# Altium schematic sheet Power.SchDoc: Power Converters
size 279 x 215 mm; DrawnBy: Kyle Hong; Engineer: Kyle Hong; Revision: 2; SheetNumber: 1; SheetTotal: 3
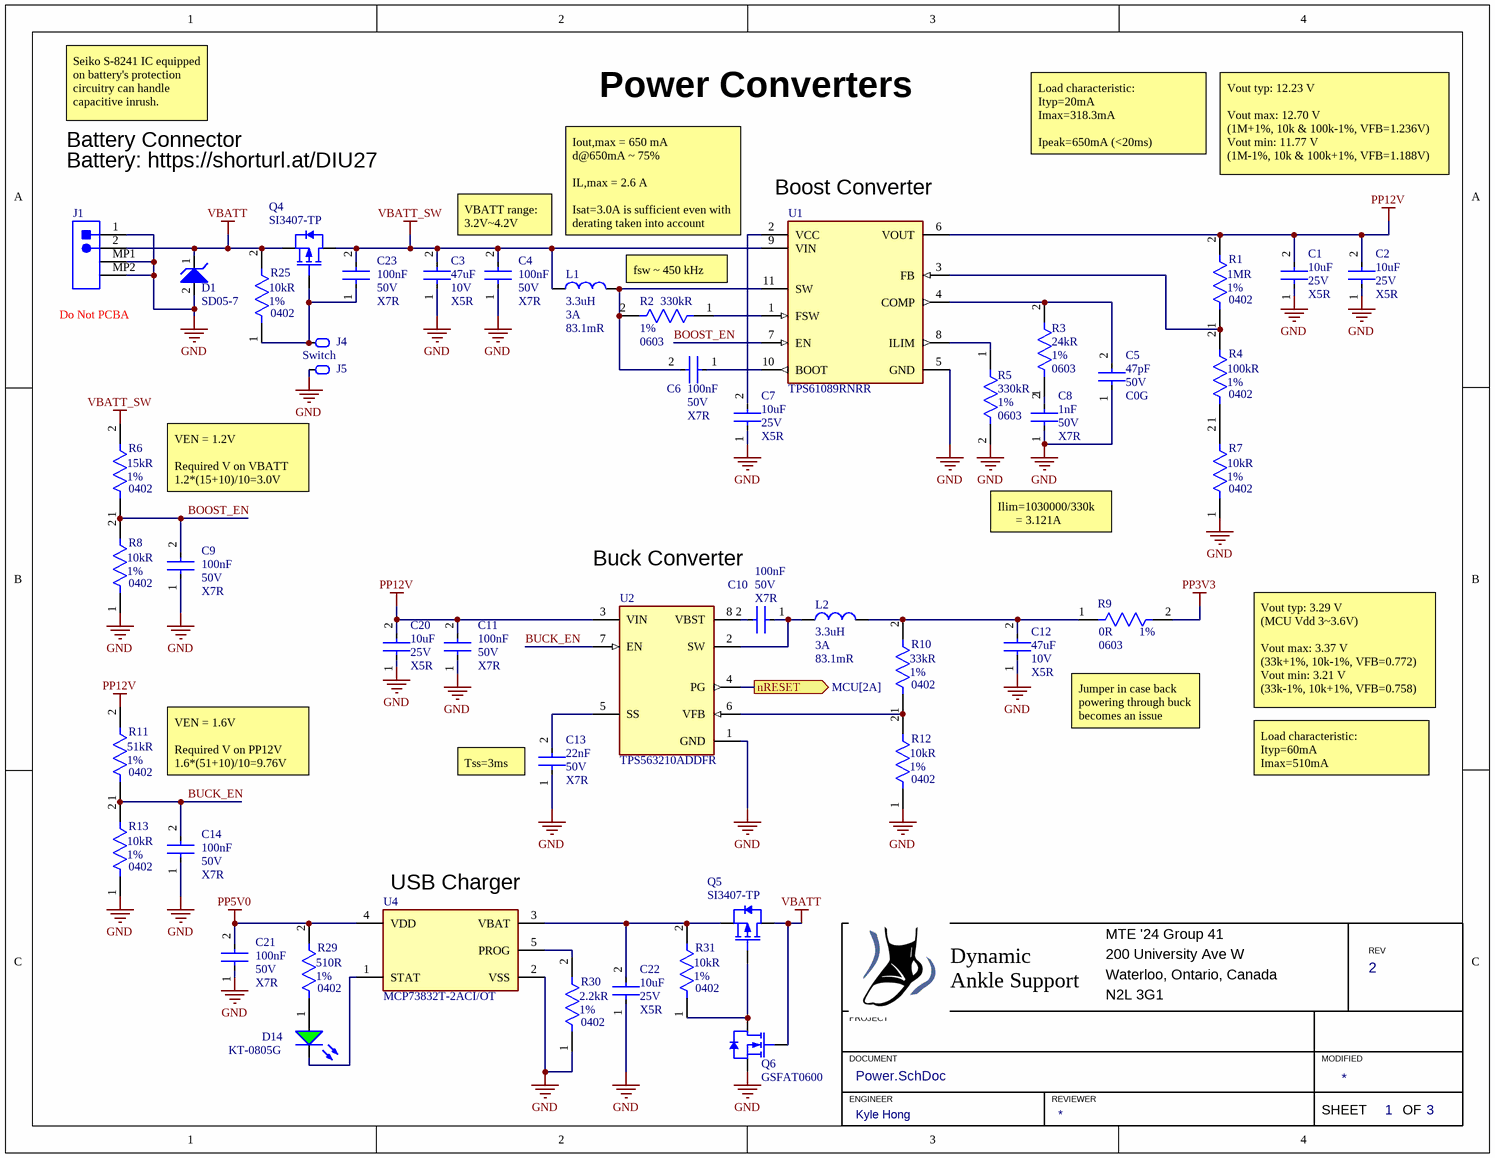
[diagram p0: Power.SchDoc]

## Parts
C1  Dielectric: X5R  Voltage Rating: 25V  Capacitance: 10uF  [CAP0805]  (hidden comment: CL21A106KAYNNNE)
C2  Dielectric: X5R  Voltage Rating: 25V  Capacitance: 10uF  [CAP0805]  (hidden comment: CL21A106KAYNNNE)
C3  Dielectric: X5R  Voltage Rating: 10V  Capacitance: 47uF  [CAP1206]  (hidden comment: CL31A476MPHNNNE)
C4  Dielectric: X7R  Voltage Rating: 50V  Capacitance: 100nF  [CAP0402]  (hidden comment: CL05B104KB54PNC)
C5  Dielectric: C0G  Voltage Rating: 50V  Capacitance: 47pF  [CAP0402]  (hidden comment: 0402CG470J500NT)
C6  Dielectric: X7R  Voltage Rating: 50V  Capacitance: 100nF  [CAP0402]  (hidden comment: CL05B104KB54PNC)
C7  Dielectric: X5R  Voltage Rating: 25V  Capacitance: 10uF  [CAP0805]  (hidden comment: CL21A106KAYNNNE)
C8  Dielectric: X7R  Voltage Rating: 50V  Capacitance: 1nF  [CAP0402]  (hidden comment: 0402B102K500NT)
C9  Dielectric: X7R  Voltage Rating: 50V  Capacitance: 100nF  [CAP0402]  (hidden comment: CL05B104KB54PNC)
C10  Dielectric: X7R  Voltage Rating: 50V  Capacitance: 100nF  [CAP0402]  (hidden comment: CL05B104KB54PNC)
C11  Dielectric: X7R  Voltage Rating: 50V  Capacitance: 100nF  [CAP0402]  (hidden comment: CL05B104KB54PNC)
C12  Dielectric: X5R  Voltage Rating: 10V  Capacitance: 47uF  [CAP1206]  (hidden comment: CL31A476MPHNNNE)
C13  Dielectric: X7R  Voltage Rating: 50V  Capacitance: 22nF  [CAP0402]  (hidden comment: 0402B223K500NT)
C14  Dielectric: X7R  Voltage Rating: 50V  Capacitance: 100nF  [CAP0402]  (hidden comment: CL05B104KB54PNC)
C20  Dielectric: X5R  Voltage Rating: 25V  Capacitance: 10uF  [CAP0805]  (hidden comment: CL21A106KAYNNNE)
C21  Dielectric: X7R  Voltage Rating: 50V  Capacitance: 100nF  [CAP0402]  (hidden comment: CL05B104KB54PNC)
C22  Dielectric: X5R  Voltage Rating: 25V  Capacitance: 10uF  [CAP0805]  (hidden comment: CL21A106KAYNNNE)
C23  Dielectric: X7R  Voltage Rating: 50V  Capacitance: 100nF  [CAP0402]  (hidden comment: CL05B104KB54PNC)
D1  SD05-7  [SD05-7]
D14  KT-0805G  [LED_0805_GREEN]
J1  S2B-PH-SM4-TB(LF)(SN)  [JST- S2B-PH-SM4-TB(LF)(SN)-2_V]  (value not drawn)
J4  SOLDER_PAD  [SOLDER_PAD]  (value not drawn)
J5  SOLDER_PAD  [SOLDER_PAD]  (value not drawn)
L1  DC Resistance: 83.1mR  Isat(min): 3A  Inductance: 3.3uH  [TMPA0503S-3R3MN-D]  (hidden comment: IHLP1616BZER3R3M5A)
L2  DC Resistance: 83.1mR  Isat(min): 3A  Inductance: 3.3uH  [TMPA0503S-3R3MN-D]  (hidden comment: IHLP1616BZER3R3M5A)
Q4  SI3407-TP  [SOT23-3]
Q5  SI3407-TP  [SOT23-3]
Q6  GSFAT0600  [SOT-523]
R1  Tolerance: 1%  Resistance: 1MR  Package: 0402  [RES0402]  (hidden comment: 0402WGF1004TCE)
R2  Tolerance: 1%  Resistance: 330kR  Package: 0603  [RES0603]  (hidden comment: 0603WAF3303T5E)
R3  Tolerance: 1%  Resistance: 24kR  Package: 0603  [RES0603]  (hidden comment: 0603WAF2402T5E)
R4  Tolerance: 1%  Resistance: 100kR  Package: 0402  [RES0402]  (hidden comment: 0402WGF1003TCE)
R5  Tolerance: 1%  Resistance: 330kR  Package: 0603  [RES0603]  (hidden comment: 0603WAF3303T5E)
R6  Tolerance: 1%  Resistance: 15kR  Package: 0402  [RES0402]  (hidden comment: 0402WGF1502TCE)
R7  Tolerance: 1%  Resistance: 10kR  Package: 0402  [RES0402]  (hidden comment: 0402WGF1002TCE)
R8  Tolerance: 1%  Resistance: 10kR  Package: 0402  [RES0402]  (hidden comment: 0402WGF1002TCE)
R9  Tolerance: 1%  Resistance: 0R  Package: 0603  [RES0603]  (hidden comment: 0603WAF0000T5E)
R10  Tolerance: 1%  Resistance: 33kR  Package: 0402  [RES0402]  (hidden comment: 0402WGF3302TCE)
R11  Tolerance: 1%  Resistance: 51kR  Package: 0402  [RES0402]  (hidden comment: 0402WGF5102TCE)
R12  Tolerance: 1%  Resistance: 10kR  Package: 0402  [RES0402]  (hidden comment: 0402WGF1002TCE)
R13  Tolerance: 1%  Resistance: 10kR  Package: 0402  [RES0402]  (hidden comment: 0402WGF1002TCE)
R25  Tolerance: 1%  Resistance: 10kR  Package: 0402  [RES0402]  (hidden comment: 0402WGF1002TCE)
R29  Tolerance: 1%  Resistance: 510R  Package: 0402  [RES0402]  (hidden comment: 0402WGF5100TCE)
R30  Tolerance: 1%  Resistance: 2.2kR  Package: 0402  [RES0402]  (hidden comment: 0402WGF2201TCE)
R31  Tolerance: 1%  Resistance: 10kR  Package: 0402  [RES0402]  (hidden comment: 0402WGF1002TCE)
U1  TPS61089RNRR  [FP-RNR0011A-MFG]
U2  TPS563210ADDFR  [TPS563210ADDFR]
U4  MCP73832T-2ACI/OT  [FP-C04-091-OT-MFG]

## Ports
nRESET (out, see MCU[2A])

## Nets
GND: C1.1 C2.1 C3.1 C4.1 C5.1 C7.1 C8.1 C9.1 C11.1 C12.1 C13.1 C14.1 C20.1 C21.1 C22.1 D1.2 J1.1 J1.MP1 J1.MP2 J5.1 Q6.2(SOURCE) R5.2 R7.1 R8.1 R12.1 R13.1 R30.1 U1.5(GND) U2.1(GND) U4.2(VSS)
PP3V3: R9.2
PP5V0: C21.2 R29.2 U4.4(VDD)
PP12V: C1.2 C2.2 C11.2 C20.2 R1.2 R11.2 U1.6(VOUT) U2.3(VIN)
VBATT: D1.1 J1.2 Q4.2(Source) Q5.3(Drain) Q6.1(GATE) R25.2
VBATT_SW: C3.2 C4.2 C23.2 L1.1 Q4.3(Drain) R6.2 U1.9(VIN)
BOOST_EN: C9.2 R6.1 R8.2 U1.7(EN)
BUCK_EN: C14.2 R11.1 R13.2 U2.7(EN)
nRESET: U2.4(PG) ; port nRESET
NetC5_2: C5.2 R3.2 U1.4(COMP)
NetC6_1: C6.1 U1.10(BOOT)
NetC6_2: C6.2 L1.2 R2.2 U1.11(SW)
NetC7_2: C7.2 U1.2(VCC)
NetC8_2: C8.2 R3.1
NetC10_1: C10.1 L2.1 U2.2(SW)
NetC10_2: C10.2 U2.8(VBST)
NetC12_2: C12.2 L2.2 R9.1 R10.2
NetC13_2: C13.2 U2.5(SS)
NetC22_2: C22.2 Q5.2(Source) R31.2 U4.3(VBAT)
NetC23_1: C23.1 J4.1 Q4.1(Gate) R25.1
NetD14_1: D14.1(K) U4.1(STAT)
NetD14_2: D14.2(A) R29.1
NetQ5_1: Q5.1(Gate) Q6.3(DRAIN) R31.1
NetR1_1: R1.1 R4.2 U1.3(FB)
NetR2_1: R2.1 U1.1(FSW)
NetR4_1: R4.1 R7.2
NetR5_1: R5.1 U1.8(ILIM)
NetR10_1: R10.1 R12.2 U2.6(VFB)
NetR30_2: R30.2 U4.5(PROG)

## Notes on the sheet
- Power Converters
- Battery Connector
- Seiko S-8241 IC equipped on battery's protection circuitry can handle capacitive inrush.
- Load characteristic:
  Ityp=20mA
  Imax=318.3mA
  Ipeak=650mA (<20ms)
- Battery: https://shorturl.at/DIU27
- VBATT range: 3.2V~4.2V
- Iout,max = 650 mA
  d@650mA ~ 75%
  IL,max = 2.6 A
  Isat=3.0A is sufficient even with derating taken into account
- (near U1) Boost Converter
- Vout typ: 12.23 V
  Vout max: 12.70 V
  (1M+1%, 10k & 100k-1%, VFB=1.236V)
  Vout min: 11.77 V
  (1M-1%, 10k & 100k+1%, VFB=1.188V)
- fsw ~ 450 kHz
- (near J1) Do Not PCBA
- Switch
- VEN = 1.2V
  Required V on VBATT
  1.2*(15+10)/10=3.0V
- Buck Converter
- Ilim=1030000/330k
  = 3.121A
- Vout typ: 3.29 V
  (MCU Vdd 3~3.6V)
  Vout max: 3.37 V
  (33k+1%, 10k-1%, VFB=0.772)
  Vout min: 3.21 V
  (33k-1%, 10k+1%, VFB=0.758)
- VEN = 1.6V
  Required V on PP12V
  1.6*(51+10)/10=9.76V
- (near C13) Tss=3ms
- Jumper in case back powering through buck becomes an issue
- Load characteristic:
  Ityp=60mA
  Imax=510mA
- (near U4) USB Charger
- 200 University Ave W
- MTE '24 Group 41
- REV
- PROJECT
- Dynamic Ankle Support
- Waterloo, Ontario, Canada
- N2L 3G1
- DOCUMENT
- ENGINEER
- REVIEWER
- MODIFIED
- SHEET
- OF

## Library data of the parts
C1 C2 C7 C20 C22 = CAP0805: 25V 10uF X5R ±10% 0805  Multilayer Ceramic Capacitors MLCC - SMD/SMT ROHS; Manufacturer: Samsung Electro-Mechanics; Tolerance: 10%; Manufacturer Part Number: CL21A106KAYNNNE; Package: 0805
C3 C12 = CAP1206: 10V 47uF X5R ±20% 1206  Multilayer Ceramic Capacitors MLCC - SMD/SMT ROHS; Manufacturer: Samsung Electro-Mechanics; Tolerance: 20%; Manufacturer Part Number: CL31A476MPHNNNE; Package: 1206
C4 C6 C9-C11 C14 C21 C23 = CAP0402: 50V 100nF X7R ±10% 0402  Multilayer Ceramic Capacitors MLCC - SMD/SMT ROHS; Manufacturer: Samsung Electro-Mechanics; Tolerance: ±20%; Manufacturer Part Number: CL05B104KB54PNC; Package: 0402
C5 = CAP0402: 50V 47pF C0G ±5% 0402  Multilayer Ceramic Capacitors MLCC - SMD/SMT ROHS; Manufacturer: FH (Guangdong Fenghua Advanced Tech); Tolerance: ±5%; Manufacturer Part Number: 0402CG470J500NT; Package: 0402
C8 = CAP0402: 50V 1nF X7R ±10% 0402  Multilayer Ceramic Capacitors MLCC - SMD/SMT ROHS; Manufacturer: FH (Guangdong Fenghua Advanced Tech); Tolerance: ±10%; Manufacturer Part Number: 0402B102K500NT; Package: 0402
C13 = CAP0402: 50V 22nF X7R ±10% 0402  Multilayer Ceramic Capacitors MLCC - SMD/SMT ROHS; Manufacturer: FH (Guangdong Fenghua Advanced Tech); Tolerance: 10%; Manufacturer Part Number: 0402B223K500NT; Package: 0402
D1 = SD05-7: TVS UNI14.5V 6.2V 5V SOD-323; Manufacturer: Diodes Incorporated; Clamping Voltage: 14.5V; Breakdown Voltage: 6.2V; Reverse Standoff Voltage: 5V; Package: SOD-323; Manufacturer Part Number: SD05-7
D14 = LED_GREEN: Emerald 0805  Light Emitting Diodes (LED) ROHS; Manufacturer: Hubei KENTO Elec; Vf: 2.1V; If rated: 20mA; Manufacturer Part Number: KT-0805G
J1 = CMP-1755-00001-1: Male Header, Pitch 2 mm, 1 x 2 Position, Height 5.5 mm, -25 to 85 degC, RoHS, Tape and Reel; Current Rating: 3 A; ComponentLink1URL: http://www.jst.com/home2.html; Radiation Hardening: No; RoHSCompliant: True; Mount: Through Hole; Contact Material: Bronze; Package Quantity: 100; Width: 2.34 mm; DatasheetVersion: Dec-12; Height: 8.13 mm; Max Operating Temperature: 105degC; ComponentLink2Description: Datasheet; Lead Pitch: 0.1 inch; Contact Finish: Lead; Packaging: Bulk; Colour: Black; Contact Plating: Tin; Min Operating Temperature: -65degC; ComponentLink1Description: Manufacturer URL; PackageReference: S2B-PH-SM4-TB(LF)(SN)-2; PackageDescription: Male Header, Pitch 2 mm, 1 x 2 Position, Height 5.5 mm; ComponentLink2URL: http://www.jst-mfg.com/product/pdf/eng/ePH.pdf; Pins: 40; Length: 101.19 mm
L1 L2 = TMPA0503S-3R3MN-D: 3.3uH ±20% 3A SMD Power Inductors ROHS; Manufacturer: Vishay Intertech; Manufacturer Part Number: IHLP1616BZER3R3M5A; Tolerance: 20%
Q4 Q5 = IRLML5103TRPBF: MOSFET P-CH 30V 4.1A SOT23; Manufacturer 1: Micro Commercial Co; Vgs (Max): ±20V; Power Dissipation (Max): 1.3W; Vth (Max): 3V @250uA; Vdss: 30V; Mounting Type: SMD; Manufacturer Part Number 1: SI3407-TP; Supplier 1: Digikey; Supplier Part Number 1: SI3407-TPMSCT-ND
Q6 = DMN62D0UT-7: MOSFET, N-CH, SINGLE, 0.30A, 60V; Vgs(th) (Max) @ Id: 2.5V @ 250uA; Vgs (Max): ±20V; Id @ 25°C: 300mA; Vdss: 60V; Package: SOT-523; Supplier 1: Digikey; Supplier Part Number 1: 4786-GSFAT0600CT-ND
R1 = RES0402: 62.5mW Thick Film Resistors ±100ppm/℃ ±1% 1MΩ 0402  Chip Resistor - Surface Mount ROHS; Manufacturer: UNI-ROYAL(Uniroyal Elec); Power Rating: 62.5mW; Manufacturer Part Number: 0402WGF1004TCE
R2 R5 = RES0603: 100mW Thick Film Resistors ±100ppm/℃ ±1% 330kΩ 0603  Chip Resistor - Surface Mount ROHS; Manufacturer: UNI-ROYAL(Uniroyal Elec); Power Rating: 100mW; Manufacturer Part Number: 0603WAF3303T5E
R3 = RES0603: 100mW Thick Film Resistors ±100ppm/℃ ±1% 24kΩ 0603  Chip Resistor - Surface Mount ROHS; Manufacturer: UNI-ROYAL(Uniroyal Elec); Power Rating: 100mW; Manufacturer Part Number: 0603WAF2402T5E
R4 = RES0402: 62.5mW Thick Film Resistors ±100ppm/℃ ±1% 100kΩ 0402  Chip Resistor - Surface Mount ROHS; Manufacturer: UNI-ROYAL(Uniroyal Elec); Power Rating: 62.5mW; Manufacturer Part Number: 0402WGF1003TCE
R6 = RES0402: 62.5mW Thick Film Resistors ±100ppm/℃ ±1% 15kΩ 0402  Chip Resistor - Surface Mount ROHS; Manufacturer: UNI-ROYAL(Uniroyal Elec); Power Rating: 62.5mW; Manufacturer Part Number: 0402WGF1502TCE
R7 R8 R12 R13 R25 R31 = RES0402: 62.5mW Thick Film Resistors ±100ppm/℃ ±1% 10kΩ 0402  Chip Resistor - Surface Mount ROHS; Manufacturer: UNI-ROYAL(Uniroyal Elec); Power Rating: 62.5mW; Manufacturer Part Number: 0402WGF1002TCE
R9 = RES0603: 100mW Thick Film Resistors ±1% 0Ω 0603  Chip Resistor - Surface Mount ROHS; Manufacturer: UNI-ROYAL(Uniroyal Elec); Power Rating: 100mW; Manufacturer Part Number: 0603WAF0000T5E
R10 = RES0402: 62.5mW Thick Film Resistors ±100ppm/℃ ±1% 33kΩ 0402  Chip Resistor - Surface Mount ROHS; Manufacturer: UNI-ROYAL(Uniroyal Elec); Power Rating: 62.5mW; Manufacturer Part Number: 0402WGF3302TCE
R11 = RES0402: 62.5mW Thick Film Resistors ±100ppm/℃ ±1% 51kΩ 0402  Chip Resistor - Surface Mount ROHS; Manufacturer: UNI-ROYAL(Uniroyal Elec); Power Rating: 62.5mW; Manufacturer Part Number: 0402WGF5102TCE
R29 = RES0402: 62.5mW Thick Film Resistors ±100ppm/℃ ±1% 510Ω 0402  Chip Resistor - Surface Mount ROHS; Manufacturer: UNI-ROYAL(Uniroyal Elec); Power Rating: 62.5mW; Manufacturer Part Number: 0402WGF5100TCE
R30 = RES0402: 62.5mW Thick Film Resistors ±100ppm/℃ ±1% 2.2kΩ 0402  Chip Resistor - Surface Mount ROHS; Manufacturer: UNI-ROYAL(Uniroyal Elec); Power Rating: 62.5mW; Manufacturer Part Number: 0402WGF2201TCE
U1 = CMP-04918-000107-1: IC REG BOOST ADJ 7A 11VQFN; Manufacturer: Texas Instruments; Nominal Supply Current: 10uA; Output Type: AdjustableProgrammable; Max Junction Temp: +125°C; Switching Frequency: 200-2200kHz; Min Supply Voltage: 2.7V; Output Current: 8.1-10A; Number Of Outputs: 1; Standoff Height: 0mm; Max Supply Voltage: 12V; Output Voltage: 4.5-12.6V; Max Duty Cycle: 90%; Automotive: No; Height: 1mm; Manufacturer Part Number: TPS61089RNRR; Temperature Range Low: -40°C; Temperature Range High: +85°C; Temperature: -40°C to +85°C; Package: 11VQFN; Digikey Description: IC REG BOOST ADJ 7A 11VQFN; Device Class L2: Power Management ICs; Category: IC; ComponentLink2Description: Datasheet; Device Class L3: Voltage Regulators - Switching; Lead Free: Yes; Octopart: https://octopart.com/tps61089rnrr-texas+instruments-68059594; RoHS: TRUE; ComponentLink2URL: http://www.ti.com/lit/ds/symlink/tps61089.pdf; Switching Topology: Boost; Device Class L1: Integrated Circuits (ICs)
U2 = TPS563210ADDFR: IC REG BUCK ADJ 3A SOT-23-8; Manufacturer: Texas Instruments; Supplier 1: Mouser; Supplier Part Number 1: 595-TPS563210ADDFR; Manufacturer Part Number: TPS563210ADDFR; Package: SOT-23-8
U4 = CMP-0133-00138-2: IC LI-ION/LI-POLY CTRLR SOT23-5; Output Current: 10mA; Output Voltage: 4.2V; Max Output Current: 500mA; Max Power Dissipation: 1.54W; Min Output Voltage: 4.168V; Number of Channels: 1; Max Supply Voltage: 6V; Min Supply Voltage: 3.75V; Max Output Voltage: 4.5V; Case/Package: SOT-23; Lead Free: Lead Free; Termination: SMD/SMT; Min Operating Temperature: -40°C; Max Operating Temperature: 85°C; Height: 1.3mm; Length: 3.1mm; Mount: Surface Mount; Package Quantity: 3000; Number of Pins: 5; Packaging: Tape and Reel; REACH SVHC: No SVHC; Contact Plating: Tin; Width: 1.8mm; Number of Cells: 1; Number of Outputs: 1; Power Dissipation: 1.54W; Max Charge Current: 500mA; Max Input Voltage: 6V; Radiation Hardening: No